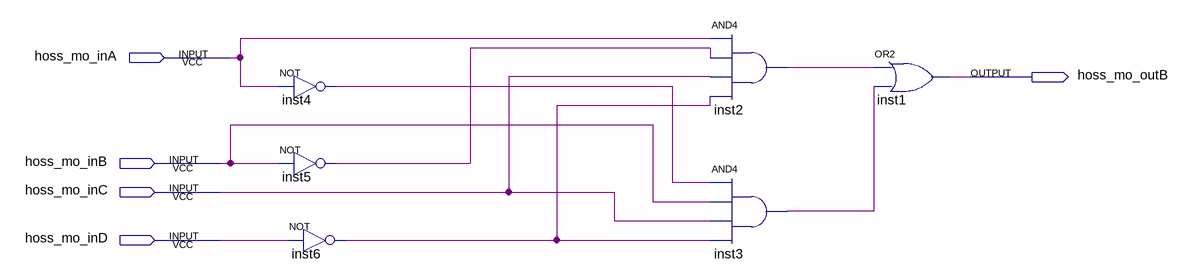
[diagram p0: schematic sheet]
// Quartus schematic segmentB.bdf as structural Verilog: 6 symbols, 5 pins
module segmentB (
  input  hoss_mo_inA,
  input  hoss_mo_inB,
  input  hoss_mo_inC,
  input  hoss_mo_inD,
  output hoss_mo_outB
);

  wire inst2_out, inst3_out, inst4_out, inst5_out, inst6_out;

  not inst4 (inst4_out, hoss_mo_inA);
  not inst5 (inst5_out, hoss_mo_inB);
  not inst6 (inst6_out, hoss_mo_inD);
  and inst2 (inst2_out, hoss_mo_inA, inst5_out, hoss_mo_inC, inst6_out);
  and inst3 (inst3_out, inst4_out, hoss_mo_inB, hoss_mo_inC, inst6_out);
  or inst1 (hoss_mo_outB, inst2_out, inst3_out);
endmodule
